# EAGLE design PSU-Unit (EAGLE 8.2.0)
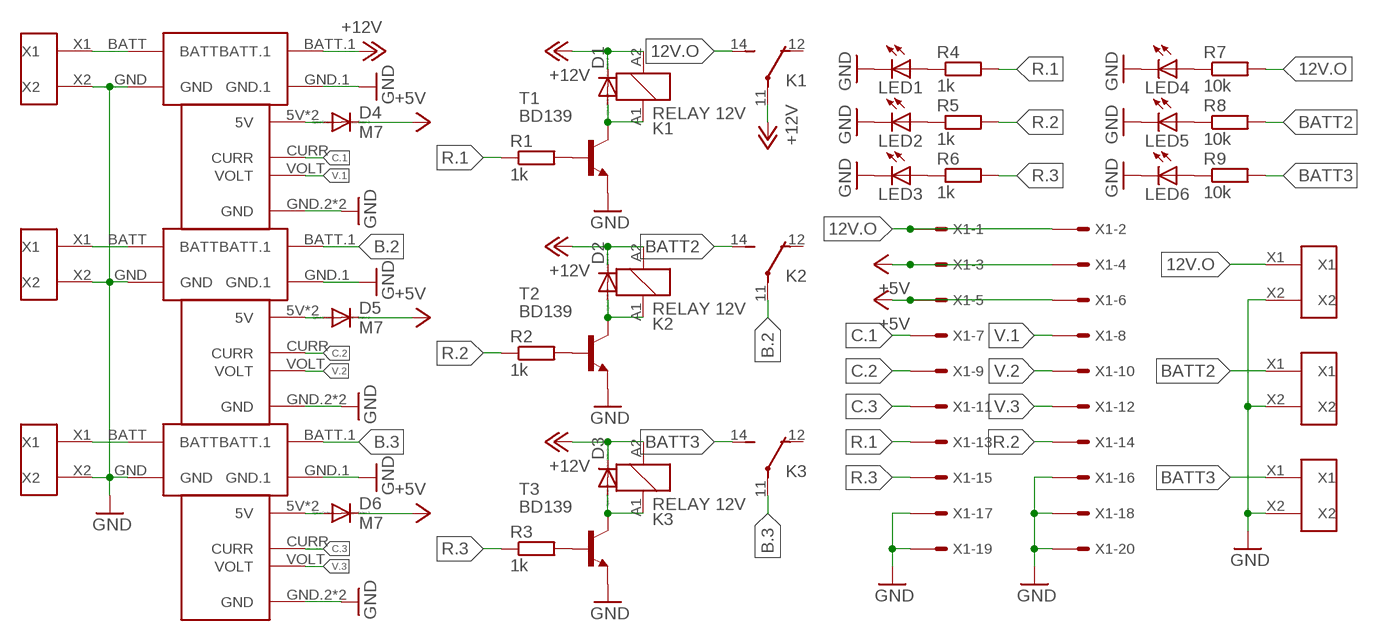
[diagram p0: schematic, sheet 1]

## Parts
D1  DIODE-DO214AA  [DO214AA]
D2  DIODE-DO214AA  [DO214AA]
D3  DIODE-DO214AA  [DO214AA]
D4  M7  DIODE-DO214AA  [DO214AA]
D5  M7  DIODE-DO214AA  [DO214AA]
D6  M7  DIODE-DO214AA  [DO214AA]
K1  RELAY 12V  ZD312006  [ZD1]
K2  RELAY 12V  ZD312006  [ZD1]
K3  RELAY 12V  ZD312006  [ZD1]
LED1  LEDCHIPLED_1206  [CHIPLED_1206]
LED2  LEDCHIPLED_1206  [CHIPLED_1206]
LED3  LEDCHIPLED_1206  [CHIPLED_1206]
LED4  LEDCHIPLED_1206  [CHIPLED_1206]
LED5  LEDCHIPLED_1206  [CHIPLED_1206]
LED6  LEDCHIPLED_1206  [CHIPLED_1206]
R1  1k  R-EU_R0805  [R0805]
R2  1k  R-EU_R0805  [R0805]
R3  1k  R-EU_R0805  [R0805]
R4  1k  R-EU_R0805  [R0805]
R5  1k  R-EU_R0805  [R0805]
R6  1k  R-EU_R0805  [R0805]
R7  10k  R-EU_R0805  [R0805]
R8  10k  R-EU_R0805  [R0805]
R9  10k  R-EU_R0805  [R0805]
T1  BD139  -NPN-TO126V  [TO126V]
T2  BD139  -NPN-TO126V  [TO126V]
T3  BD139  -NPN-TO126V  [TO126V]
U$1  APM-POWER-MODULE  [APM-POWER-MODULE]
U$2  APM-MEASURAND  [APM-MEASURAND]
U$3  APM-POWER-MODULE  [APM-POWER-MODULE]
U$4  APM-MEASURAND  [APM-MEASURAND]
U$5  APM-POWER-MODULE  [APM-POWER-MODULE]
U$6  APM-MEASURAND  [APM-MEASURAND]
U$7  T-BLOCK-9.5MM  [T-BLOCK-9.5MM]
U$8  T-BLOCK-9.5MM  [T-BLOCK-9.5MM]
U$9  T-BLOCK-9.5MM  [T-BLOCK-9.5MM]
U$10  T-BLOCK-9.5MM  [T-BLOCK-9.5MM]
U$11  T-BLOCK-9.5MM  [T-BLOCK-9.5MM]
U$12  T-BLOCK-9.5MM  [T-BLOCK-9.5MM]
X1  057-020-1  [057-020-1]

## Nets
12V.O: K1.14(2:S) R7.2 U$10.X1 X1.1 X1.2
+5V: D4.C D5.C D6.C X1.3 X1.4 X1.5 X1.6
+12V: D1.C D2.C D3.C K1.11(2:P) K1.A2 K2.A2 K3.A2 U$1.BATT.1
B.2: K2.11(2:P) U$3.BATT.1
B.3: K3.11(2:P) U$5.BATT.1
BATT2: K2.14(2:S) R8.2 U$11.X1
BATT3: K3.14(2:S) R9.2 U$12.X1
C.1: U$2.CURR X1.7
C.2: U$4.CURR X1.9
C.3: U$6.CURR X1.11
GND: LED1.C LED2.C LED3.C LED4.C LED5.C LED6.C T1.1(E) T2.1(E) T3.1(E) U$1.GND U$1.GND.1 U$2.GND.2(GND) U$2.GND.3(GND) U$3.GND U$3.GND.1 U$4.GND.2(GND) U$4.GND.3(GND) U$5.GND U$5.GND.1 U$6.GND.2(GND) U$6.GND.3(GND) U$7.X2 U$8.X2 U$9.X2 U$10.X2 U$11.X2 U$12.X2 X1.16 X1.17 X1.18 X1.19 X1.20
N$1: D1.A K1.A1 T1.2(C)
N$2: D4.A U$2.5V U$2.5V.1(5V)
N$3: R1.2 T1.3(B)
N$4: D5.A U$4.5V U$4.5V.1(5V)
N$5: D2.A K2.A1 T2.2(C)
N$6: R2.2 T2.3(B)
N$7: D6.A U$6.5V U$6.5V.1(5V)
N$8: D3.A K3.A1 T3.2(C)
N$9: R3.2 T3.3(B)
N$10: U$1.BATT U$7.X1
N$11: U$3.BATT U$8.X1
N$12: U$5.BATT U$9.X1
N$13: LED1.A R4.1
N$14: LED2.A R5.1
N$15: LED3.A R6.1
N$16: LED4.A R7.1
N$17: LED5.A R8.1
N$18: LED6.A R9.1
R.1: R1.1 R4.2 X1.13
R.2: R2.1 R5.2 X1.14
R.3: R3.1 R6.2 X1.15
V.1: U$2.VOLT X1.8
V.2: U$4.VOLT X1.10
V.3: U$6.VOLT X1.12
Unconnected: K1.12(2:O) K2.12(2:O) K3.12(2:O)

## Library data of the parts
D1-D6 = diode:DIODE-: DIODE
K1-K3 = relay:ZD?1*: Power Relay SCHRACK 1 pole 30 A Source: http://www.schrack.com/.. 5848.pdf; OC_FARNELL: unknown; OC_NEWARK: unknown
LED1-LED6 = led:LED: LED OSRAM: - CHIPLED LG R971, LG N971, LY N971, LG Q971, LY Q971, LO R971, LY R971 LH N974, LH R974 LS Q976, LO Q976, LY Q976 LO Q996 - Hyper CHIPLED LW Q18S LB Q993, LB Q99A, LB R99A - SideLED LS A670, LO A670, LY A670, LG A670, LP A670 LB A673, LV A673, LT A673, LW A673 LH A674 LY A675 LS A676, LA A676, LO A676, LY A676, LW A676 LS A679, LY A679, LG A679 - Hyper Micro SIDELED® LS Y876, LA Y876, LO Y876, LY Y876 LT Y87S - SmartLED LW L88C, LW L88S LB L89C, LB L89S, LG L890 LS L89K, LO L89K, LY L89K LS L896, LA L896, LO L896, LY L896 - TOPLED LS T670, LO T670, LY T670, LG T670, LP T670 LSG T670, LSP T670, LSY T670, LOP T670, LYG T670 LG T671, LOG T671, LSG T671 LB T673, LV T673, LT T673, LW T673 LH T674 LS T676, LA T676, LO T676, LY T676, LB T676, LH T676, LSB T676, LW T676 LB T67C, LV T67C, LT T67C, LS T67K, LO T67K, LY T67K, LW E67C LS E67B, LA E67B, LO E67B, LY E67B, LB E67C, LV E67C, LT E67C LW T67C LS T679, LY T679, LG T679 LS T770, LO T770, LY T770, LG T770, LP T770 LB T773, LV T773, LT T773, LW T773 LH T774 LS E675, LA E675, LY E675, LS T675 LS T776, LA T776, LO T776, LY T776, LB T776 LHGB T686 LT T68C, LB T68C - Hyper Mini TOPLED® LB M676 - Mini TOPLED Santana® LG M470 LS M47K, LO M47K, LY M47K Source: http://www.osram.convergy.de LUXEON: - LUMILED® LXK2-PW12-R00, LXK2-PW12-S00, LXK2-PW14-U00, LXK2-PW14-V00 LXK2-PM12-R00, LXK2-PM12-S00, LXK2-PM14-U00 LXK2-PE12-Q00, LXK2-PE12-R00, LXK2-PE12-S00, LXK2-PE14-T00, LXK2-PE14-U00 LXK2-PB12-K00, LXK2-PB12-L00, LXK2-PB12-M00, LXK2-PB14-N00, LXK2-PB14-P00, LXK2-PB14-Q00 LXK2-PR12-L00, LXK2-PR12-M00, LXK2-PR14-Q00, LXK2-PR14-R00 LXK2-PD12-Q00, LXK2-PD12-R00, LXK2-PD12-S00 LXK2-PH12-R00, LXK2-PH12-S00 LXK2-PL12-P00, LXK2-PL12-Q00, LXK2-PL12-R00 Source: www.luxeon.com KINGBRIGHT: KA-3528ASYC Source: www.kingbright.com
R1-R9 = rcl:R-EU_: RESISTOR, European symbol
T1-T3 = transistor:*-NPN-: NPN Transistror BF959 corrected 2008.03.06
U$1 U$3 U$5 = adafruit-other-customs:APM-POWER-MODULE
U$2 U$4 U$6 = adafruit-other-customs:APM-MEASURAND
U$7-U$12 = adafruit-other-customs:T-BLOCK-9.5MM
X1 = con-panduit:057-020-: CONNECTOR 20-pin series 057 contact pc board low profile headers; OC_FARNELL: unknown; OC_NEWARK: unknown

## Board
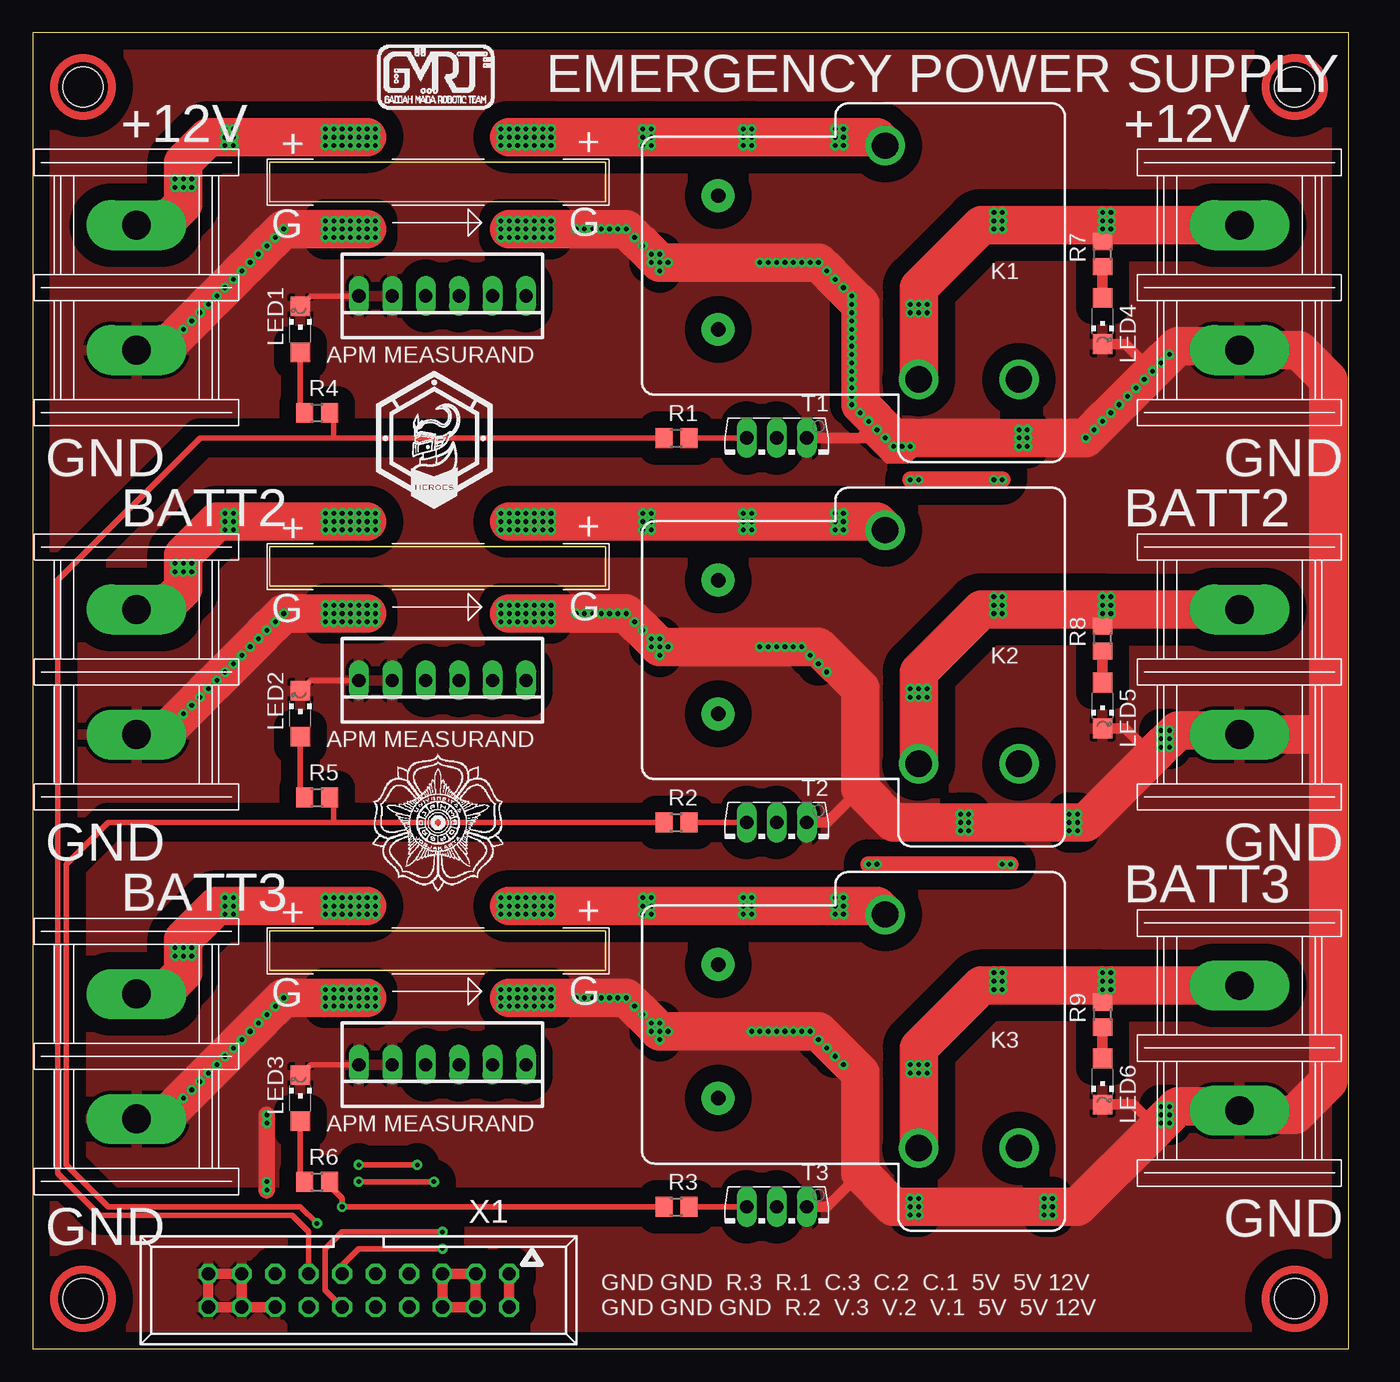
[diagram p1: board, top side]
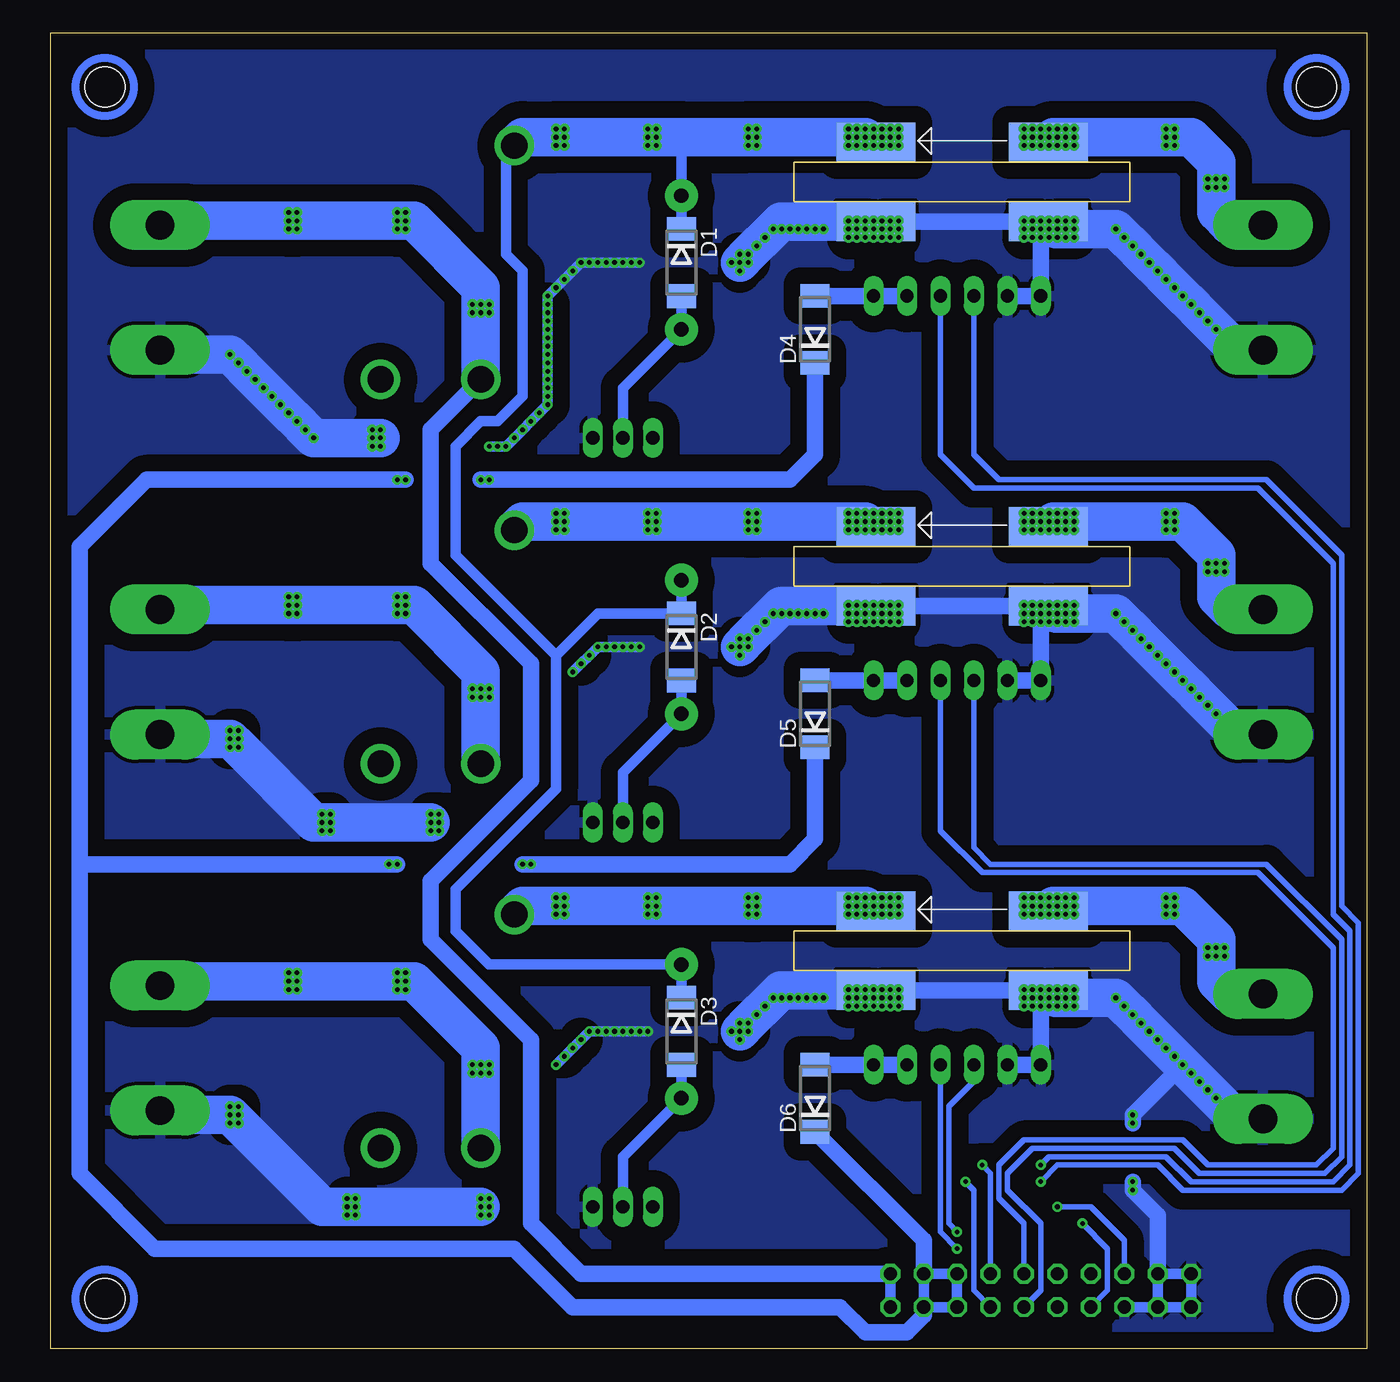
[diagram p2: board, bottom side, seen from below]

Size 100 x 100 mm. Coordinates in mm from the lower left corner, seen from the top.
Outline: 0,0 100,0 100,100 0,100 0,0
Copper layers (1*16): Top 0.035mm / dielectric 1.5mm / Bottom 0.035mm
Design rules "default": minimum track width 6mil, minimum drill 0.35mm, track to track 6mil, track to pad 6mil, pad to pad 6mil, via to via 6mil, smd to smd 6mil, copper to edge 40mil, drill to drill 6mil, minimum pad ring 10mil, minimum via ring 8mil, stop-mask expansion 4mil, vias tented up to drill 0mil, thermal gap 10mil

### Footprints (pad centres in the part's own frame; a part is rotated, then mirrored left to right if it is on the bottom)
DO214AA = smd 1.8 x 2.2: A 2.55,0; C -2.55,0
ZD1 = drill 2 pad 2.5: 11 -2.54,-8.88; 12 -12.7,8.88; 14 -5.08,8.88 | drill 1.1 pad 2.5: A1 10.16,5.08; A2 10.16,-5.08
CHIPLED_1206 = smd 1.5 x 1.5: A 0,-1.75; C 0,1.75
R0805 = smd 1.3 x 1.5: 1 -0.95,0; 2 0.95,0
TO126V = drill 1.016 long: 1 -2.286,-1.27; 2 0,-1.27; 3 2.286,-1.27
APM-POWER-MODULE = smd 6 x 3 bottom: BATT -6.921,2.794; BATT.1 6.16,2.794; GND -6.921,-3.239; GND.1 6.16,-3.239
APM-MEASURAND = drill 1 long: 5V -6.35,0; 5V.1 -3.81,0; CURR -1.27,0; GND.2 3.81,0; GND.3 6.35,0; VOLT 1.27,0
T-BLOCK-9.5MM = drill 2.184 pad 3.81 long: X1 -4.75,0.25; X2 4.75,0.25
HOLE-3MM = hole 3.05: 0,0
057-020-1 = drill 1 octagon: 1 -11.43,-1.27; 2 -11.43,1.27; 3 -8.89,-1.27; 4 -8.89,1.27; 5 -6.35,-1.27; 6 -6.35,1.27; 7 -3.81,-1.27; 8 -3.81,1.27; 9 -1.27,-1.27; 10 -1.27,1.27; 11 1.27,-1.27; 12 1.27,1.27; 13 3.81,-1.27; 14 3.81,1.27; 15 6.35,-1.27; 16 6.35,1.27; 17 8.89,-1.27; 18 8.89,1.27; 19 11.43,-1.27; 20 11.43,1.27

### Placement (x,y rotation side)
D1  52.07,82.55 270 bottom
D2  52.07,53.34 270 bottom
D3  52.07,24.13 270 bottom
D4  41.91,77.47 90 bottom
D5  41.91,48.26 90 bottom
D6  41.91,19.05 90 bottom
K1  62.23,82.55 180 top
K2  62.23,53.34 180 top
K3  62.23,24.13 180 top
LED1  20.32,77.47 0 top
LED2  20.32,48.26 0 top
LED3  20.32,19.05 0 top
LED4  81.28,78.11 180 top
LED5  81.28,48.9 180 top
LED6  81.28,20.32 180 top
R1  48.9,69.22 0 top
R2  48.9,40.01 0 top
R3  48.9,10.79 0 top
R4  21.59,71.12 0 top
R5  21.59,41.91 0 top
R6  21.59,12.7 0 top
R7  81.28,83.19 90 top
R8  81.28,53.98 90 top
R9  81.28,25.4 90 top
T1  56.52,67.94 180 top
T2  56.52,38.73 180 top
T3  56.52,9.53 180 top
U$1  31.11,88.9 0 top
U$2  31.11,80.01 180 top
U$3  31.11,59.69 0 top
U$4  31.11,50.8 180 top
U$5  31.11,30.48 0 top
U$6  31.11,21.59 180 top
U$7  7.62,80.64 270 top
U$8  7.62,51.44 270 top
U$9  7.62,22.23 270 top
U$10  91.44,80.64 270 top
U$11  91.44,51.44 270 top
U$12  91.44,22.86 270 top
U$13  [HOLE-3MM]  3.81,95.89 0 top
U$14  [HOLE-3MM]  3.81,3.81 0 top
U$15  [HOLE-3MM]  95.89,95.89 0 top
U$16  [HOLE-3MM]  95.89,3.81 0 top
X1  24.77,4.45 180 top

### Tracks (layer width: path | path; a pad name or v marks a point on that pad's centre or on a via)
12V.O  (via drill 0.35)
  Top 0.813: R7.2 v81.28,85.09 81.28,85.39 | X1.1 X1.2
  Top 2.921: U$10.X1 81.28,85.39 72.06,85.39 67.31,80.64 v67.31,79.38 v67.31,78.74 K1.14
  Bottom 0.813: X1.1 X1.2
  Bottom 1.27: K1.14 71.12,69.85 71.12,59.69 63.5,52.07 63.5,43.18 71.12,35.56 71.12,31.11 63.5,23.5 63.5,9.53 59.69,5.71 X1.1
  Bottom 2.921: K1.14 v67.31,78.74 v67.31,79.38 67.31,80.64 72.39,85.72 v73.03,85.72 v73.66,85.72 v81.28,85.72 v81.92,85.72 91.44,85.72
+5V  (via drill 0.35)
  Top 0.813: X1.5 X1.6 X1.4 X1.3 X1.5
  Top 1.27: v66.67,66.04 v67.31,66.04 v73.03,66.04 v73.66,66.04 | v63.5,36.83 v64.14,36.83 v73.66,36.83 v74.3,36.83
  Bottom 0.813: X1.5 X1.6 X1.4 X1.3 X1.5
  Bottom 1.27: D6.C 33.66,8.26 X1.3 | D4.C 41.91,67.94 43.81,66.04 v66.67,66.04 v67.31,66.04 | 97.79,36.83 97.79,60.96 92.71,66.04 v73.66,66.04 v73.03,66.04 | 97.79,36.83 97.79,13.34 92.08,7.62 64.77,7.62 60.33,3.17 40.01,3.17 38.1,1.27 34.92,1.27 33.66,2.54 X1.4 | D5.C 41.91,38.73 43.81,36.83 v63.5,36.83 v64.14,36.83 | v73.66,36.83 v74.3,36.83 97.79,36.83
+12V  (via drill 0.35)
  Top 2.921: v36.2,92.08 v36.83,92.08 v37.47,92.08 v38.1,92.08 v38.73,92.08 v39.37,92.08 v46.35,92.08 v46.99,92.08 v53.98,92.08 v54.61,92.08 v60.96,92.08 v61.59,92.08 64.14,92.08 K1.11
  Bottom 0.813: D1.C K1.A2 52.07,92.08 | K2.A2 D2.C 58.41,55.89 61.59,52.7 | D3.C K3.A2 66.67,29.21 69.22,31.75 69.22,34.92 61.59,42.55 61.59,52.7 | 61.59,52.7 69.22,60.33 69.22,68.58 67.31,70.48 66.04,70.48 64.14,72.39 64.14,81.92 65.41,83.19 65.41,90.8 K1.11
  Bottom 2.921: U$1.BATT.1 37.72,91.69 v38.1,92.08 v38.73,92.08 v39.37,92.08 v46.35,92.08 v46.99,92.08 52.07,92.08 v53.98,92.08 v54.61,92.08 v60.96,92.08 v61.59,92.08 64.12,92.08 K1.11
B.2  (via drill 0.35)
  Top 2.921: v36.2,62.87 v36.83,62.87 v37.47,62.87 v38.1,62.87 v38.73,62.87 v39.37,62.87 v46.35,62.87 v46.99,62.87 v53.98,62.87 v54.61,62.87 v60.96,62.87 v61.59,62.87 64.14,62.87 K2.11
  Bottom 2.921: U$3.BATT.1 37.72,62.48 v38.1,62.87 v38.73,62.87 v39.37,62.87 v46.35,62.87 v46.99,62.87 v53.98,62.87 v54.61,62.87 v60.96,62.87 v61.59,62.87 64.12,62.87 K2.11
B.3  (via drill 0.35)
  Top 2.921: v36.2,33.66 v36.83,33.66 v37.47,33.66 v38.1,33.66 v38.73,33.66 v39.37,33.66 v46.35,33.66 v46.99,33.66 v53.98,33.66 v54.61,33.66 v60.96,33.66 v61.59,33.66 64.14,33.66 K3.11
  Bottom 2.921: U$5.BATT.1 37.72,33.27 v38.1,33.66 v38.73,33.66 v39.37,33.66 v46.35,33.66 v46.99,33.66 v53.98,33.66 v54.61,33.66 v60.96,33.66 v61.59,33.66 64.12,33.66 K3.11
BATT2  (via drill 0.35)
  Top 0.813: R8.2 v81.28,55.88 81.28,56.19
  Top 2.921: U$11.X1 81.28,56.19 72.06,56.19 67.31,51.44 v67.31,50.16 v67.31,49.53 K2.14
  Bottom 2.921: K2.14 v67.31,49.53 v67.31,50.16 67.31,51.44 72.39,56.52 v73.03,56.52 v73.66,56.52 v81.28,56.52 v81.92,56.52 91.44,56.52
BATT3  (via drill 0.35)
  Top 0.813: R9.2 v81.28,27.3 81.28,27.61
  Top 2.921: U$12.X1 81.28,27.61 72.06,27.61 67.31,22.86 v67.31,21.59 v67.31,20.95 K3.14
  Bottom 2.921: K3.14 v67.31,20.95 v67.31,21.59 67.31,22.86 72.39,27.94 v73.03,27.94 v73.66,27.94 v81.28,27.94 v81.92,27.94 91.44,27.94
C.1  (via drill 0.35)
  Top 0.406: v24.77,13.97 v29.21,13.97
  Bottom 0.406: U$2.CURR 32.38,67.94 29.84,65.41 8.26,65.41 2.54,59.69 2.54,33.02 1.27,31.75 1.27,13.97 2.54,12.7 13.34,12.7 15.24,14.61 24.13,14.61 v24.77,13.97 | v29.21,13.97 28.57,13.34 X1.7
C.2
  Bottom 0.406: U$4.CURR 32.38,39.37 29.21,36.2 8.26,36.2 2.54,30.48 2.54,15.24 3.81,13.97 12.06,13.97 13.97,15.88 26.04,15.88 27.94,13.97 27.94,11.43 26.04,9.53 X1.9
C.3  (via drill 0.35)
  Top 0.406: v31.11,7.62 24.77,7.62 23.5,6.35 X1.11
  Bottom 0.406: U$6.CURR 32.38,8.89 v31.11,7.62
GND  (via drill 0.35)
  Top 0.406: U$4.GND.3 21.11,50.8 LED2.C | U$2.GND.3 21.11,80.01 LED1.C | U$6.GND.3 21.11,21.59 LED3.C
  Top 0.813: T1.1 62.87,69.22 | 62.87,69.22 63.45,69.22 65.02,67.64 66.43,67.64 66.98,68.19 66.98,68.88 67.31,69.22 | T2.1 60.33,40.01 62.87,42.55 | T3.1 60.33,10.79 62.87,13.34 | 62.87,69.22 63.2,69.55 | LED4.C 83.03,76.36 v85.09,74.3 | LED5.C 83.03,47.15 85.09,45.09 | LED6.C 83.61,18.57 85.7,16.48 85.12,16.48 85.09,16.51 | X1.18 X1.20 X1.19 X1.17 X1.18 | X1.18 X1.16
  Top 1.27: v17.78,12.06 v17.78,12.7 v17.78,17.14 v17.78,17.78
  Top 2.921: v36.2,85.09 v36.83,85.09 v37.47,85.09 v38.1,85.09 v38.73,85.09 v39.37,85.09 v41.27,85.09 v41.91,85.09 v42.55,85.09 v43.18,85.09 v43.81,85.09 v44.45,85.09 v45.09,85.09 v45.72,84.45 v46.35,83.82 v46.99,83.19 v47.62,82.55 v48.26,82.55 v55.24,82.55 v55.88,82.55 v56.52,82.55 v57.15,82.55 v57.78,82.55 v58.42,82.55 v59.05,82.55 v59.69,82.55 v60.33,81.92 v60.96,81.28 v61.59,80.64 v62.23,80.01 62.87,79.38 62.87,71.75 65.41,69.22 67.31,69.22 v74.93,69.22 v75.56,69.22 v80.01,69.22 v80.64,69.85 v81.28,70.48 v81.92,71.12 v82.55,71.75 v83.19,72.39 v83.82,73.03 v84.45,73.66 v85.09,74.3 v85.72,74.93 v86.36,75.56 87,76.2 91.39,76.2 U$10.X2 96.19,75.89 98.42,73.66 98.42,46.99 | 8.26,76.2 10.16,76.2 v11.43,77.47 v12.06,78.11 v12.7,78.74 v13.34,79.38 v13.97,80.01 v14.61,80.64 v15.24,81.28 v15.88,81.92 v16.51,82.55 v17.14,83.19 v17.78,83.82 v18.41,84.45 v19.05,85.09 v22.23,85.09 v22.86,85.09 v23.5,85.09 v24.13,85.09 v24.77,85.09 v25.4,85.09 | v36.2,55.88 v36.83,55.88 v37.47,55.88 v38.1,55.88 v38.73,55.88 v39.37,55.88 v41.27,55.88 v41.91,55.88 v42.55,55.88 v43.18,55.88 v43.81,55.88 v44.45,55.88 v45.09,55.88 v45.72,55.24 v46.35,54.61 v46.99,53.98 v47.62,53.34 v48.26,53.34 v55.24,53.34 v55.88,53.34 v56.52,53.34 v57.15,53.34 v57.78,53.34 v58.42,53.34 59.69,53.34 62.87,50.16 62.87,42.55 65.41,40.01 v70.48,40.01 v71.12,40.01 v78.74,40.01 v79.38,40.01 80.01,40.01 85.09,45.09 v85.72,45.72 v86.36,46.35 87,46.99 91.44,46.99 91.44,46.94 U$11.X2 98.12,46.69 98.42,46.99 | v36.2,26.67 v36.83,26.67 v37.47,26.67 v38.1,26.67 v38.73,26.67 v39.37,26.67 v41.27,26.67 v41.91,26.67 v42.55,26.67 v43.18,26.67 v43.81,26.67 v44.45,26.67 v45.09,26.67 v45.72,26.04 v46.35,25.4 v46.99,24.77 v47.62,24.13 v48.26,24.13 v54.61,24.13 v55.24,24.13 v55.88,24.13 v56.52,24.13 v57.15,24.13 v57.78,24.13 v58.42,24.13 v59.05,24.13 59.69,24.13 62.87,20.95 62.87,13.34 65.41,10.79 v66.67,10.79 v67.31,10.79 v76.83,10.79 v77.47,10.79 79.38,10.79 85.09,16.51 v85.72,17.14 v86.36,17.78 87,18.41 91.39,18.41 U$12.X2 92.02,17.78 95.89,17.78 98.42,20.32 98.42,46.99
  Top 2.921: 7.62,46.99 10.16,46.99 v11.43,48.26 v12.06,48.9 v12.7,49.53 v13.34,50.16 v13.97,50.8 v14.61,51.44 v15.24,52.07 v15.88,52.7 v16.51,53.34 v17.14,53.98 v17.78,54.61 v18.41,55.24 v19.05,55.88 v22.23,55.88 v22.86,55.88 v23.5,55.88 v24.13,55.88 v24.77,55.88 v25.4,55.88 | 8.26,17.78 10.16,17.78 v11.43,19.05 v12.06,19.68 v12.7,20.32 v13.34,20.95 v13.97,21.59 v14.61,22.23 v15.24,22.86 v15.88,23.5 v16.51,24.13 v17.14,24.77 v17.78,25.4 v18.41,26.04 v19.05,26.67 v22.23,26.67 v22.86,26.67 v23.5,26.67 v24.13,26.67 v24.77,26.67 v25.4,26.67
  Bottom 0.813: v55.24,82.55 v59.69,82.55 v62.23,80.01 62.23,71.75 v65.41,68.58 v66.67,68.58 | v55.24,53.34 v58.42,53.34 v60.33,51.44 | v54.61,24.13 v59.05,24.13 v61.59,21.59 | X1.18 X1.16 | X1.18 X1.20 X1.19 X1.17 X1.18
  Bottom 1.27: U$1.GND.1 25.34,85.66 v24.77,85.09 U$2.GND.3 U$2.GND.2 | 24.83,56.45 U$3.GND.1 | 24.83,56.45 24.77,56.52 | U$4.GND.2 U$4.GND.3 24.77,56.39 24.83,56.45 | U$5.GND.1 24.83,27.24 24.77,27.3 v24.77,26.67 | v25.4,26.67 24.77,26.04 U$6.GND.3 U$6.GND.2 | X1.17 15.88,10.16 v17.78,12.06 v17.78,12.7 | v17.78,17.14 v17.78,17.78 v13.97,21.59
  Bottom 2.921: U$7.X2 9.86,75.89 v11.43,77.47 v12.06,78.11 v12.7,78.74 v13.34,79.38 v13.97,80.01 v14.61,80.64 v15.24,81.28 v15.88,81.92 v16.51,82.55 v17.14,83.19 v17.78,83.82 v18.41,84.45 v19.05,85.09 v22.23,85.09 v22.86,85.09 v23.5,85.09 23.62,85.09 U$1.GND | U$8.X2 9.86,46.69 v11.43,48.26 v12.06,48.9 v12.7,49.53 v13.34,50.16 v13.97,50.8 v14.61,51.44 v15.24,52.07 v15.88,52.7 v16.51,53.34 v17.14,53.98 v17.78,54.61 v18.41,55.24 v19.05,55.88 v22.23,55.88 v22.86,55.88 v23.5,55.88 23.62,55.88 U$3.GND | U$9.X2 9.86,17.48 v11.43,19.05 v12.06,19.68 v12.7,20.32 v13.34,20.95 v13.97,21.59 v14.61,22.23 v15.24,22.86 v15.88,23.5 v16.51,24.13 v17.14,24.77 v17.78,25.4 v18.41,26.04 v19.05,26.67 v22.23,26.67 v22.86,26.67 v23.5,26.67 23.62,26.67 U$5.GND | U$1.GND.1 44.51,85.66 v45.09,85.09 v45.72,84.45 v46.35,83.82 v46.99,83.19 v47.62,82.55 | U$3.GND.1 44.51,56.45 v45.09,55.88 v45.72,55.24 v46.35,54.61 v46.99,53.98 v47.62,53.34 | U$5.GND.1 44.51,27.24 v45.09,26.67 v45.72,26.04 v46.35,25.4 v46.99,24.77 v47.62,24.13 | 91.44,75.56 v86.36,75.56 v85.72,74.93 v85.09,74.3 v84.45,73.66 v83.82,73.03 v83.19,72.39 v82.55,71.75 v81.92,71.12 v81.28,70.48 v80.64,69.85 v80.01,69.22 v75.56,69.22 v74.93,69.22 | 91.44,46.35 v86.36,46.35 v85.72,45.72 80.01,40.01 v79.38,40.01 v78.74,40.01 v71.12,40.01 | 91.44,17.78 v86.36,17.78 v85.72,17.14 79.38,10.79 v77.47,10.79 v76.83,10.79 v67.31,10.79
  pour Top (isolate 1.27): 0,100.33 0,0 100.33,0 100.33,100.33
  pour Bottom (isolate 1.27): -1.27,100.33 -1.27,0 100.33,0 100.33,100.33
N$1
  Bottom 0.813: D1.A K1.A1 56.52,73.03 T1.2
N$2
  Bottom 1.27: U$2.5V.1 U$2.5V D4.A
N$3
  Top 0.406: R1.2 T1.3
N$4
  Bottom 1.27: U$4.5V.1 U$4.5V D5.A
N$5
  Bottom 0.813: T2.2 56.52,43.81 K2.A1 D2.A
N$6
  Top 0.406: R2.2 T2.3
N$7
  Bottom 1.27: U$6.5V.1 U$6.5V D6.A
N$8
  Bottom 0.813: T3.2 56.52,14.61 K3.A1 D3.A
N$9
  Top 0.406: R3.2 T3.3
N$10  (via drill 0.35)
  Top 2.921: 8.26,85.72 10.16,85.72 11.43,87 v11.43,88.27 v11.43,88.9 11.43,90.17 13.34,92.08 v14.61,92.08 v15.24,92.08 v22.23,92.08 v22.86,92.08 v23.5,92.08 v24.13,92.08 v24.77,92.08 v25.4,92.08
  Bottom 2.921: U$7.X1 10.46,85.39 11.43,86.36 v11.43,88.27 v11.43,88.9 11.43,90.17 13.34,92.08 v14.61,92.08 v15.24,92.08 v22.23,92.08 v22.86,92.08 v23.5,92.08 23.81,92.08 U$1.BATT
N$11  (via drill 0.35)
  Top 2.921: 8.26,56.52 10.16,56.52 11.43,57.78 v11.43,59.05 v11.43,59.69 11.43,60.33 13.97,62.87 v14.61,62.87 v15.24,62.87 v22.23,62.87 v22.86,62.87 v23.5,62.87 v24.13,62.87 v24.77,62.87 v25.4,62.87
  Bottom 2.921: U$8.X1 10.46,56.19 11.43,57.15 v11.43,59.05 v11.43,59.69 11.43,60.33 13.97,62.87 v14.61,62.87 v15.24,62.87 v22.23,62.87 v22.86,62.87 v23.5,62.87 23.81,62.87 U$3.BATT
N$12  (via drill 0.35)
  Top 2.921: 8.26,27.3 10.16,27.3 11.43,28.57 v11.43,29.84 v11.43,30.48 11.43,31.11 13.97,33.66 v14.61,33.66 v15.24,33.66 v22.23,33.66 v22.86,33.66 v23.5,33.66 v24.13,33.66 v24.77,33.66 v25.4,33.66
  Bottom 2.921: U$9.X1 10.46,26.98 11.43,27.94 v11.43,29.84 v11.43,30.48 11.43,31.11 13.97,33.66 v14.61,33.66 v15.24,33.66 v22.23,33.66 v22.86,33.66 v23.5,33.66 23.81,33.66 U$5.BATT
N$13
  Top 0.406: LED1.A 20.32,71.44 R4.1
N$14
  Top 0.406: LED2.A 20.32,42.23 R5.1
N$15
  Top 0.406: LED3.A 20.32,13.02 R6.1
N$16
  Top 0.813: R7.1 LED4.A
N$17
  Top 0.813: R8.1 LED5.A
N$18
  Top 0.813: R9.1 LED6.A
N$19  (via drill 0.35)
  other vias: 10.79,59.69
N$20  (via drill 0.35)
  other vias: 10.79,59.05
N$21  (via drill 0.35)
  other vias: 12.06,59.05
N$22  (via drill 0.35)
  other vias: 14.61,33.02
N$23  (via drill 0.35)
  other vias: 26.04,34.29
N$24  (via drill 0.35)
  other vias: 54.61,92.71
N$25  (via drill 0.35)
  other vias: 10.79,88.27
N$26  (via drill 0.35)
  other vias: 12.06,88.27
N$27  (via drill 0.35)
  other vias: 12.06,88.9
N$28  (via drill 0.35)
  other vias: 10.79,88.9
N$29  (via drill 0.35)
  other vias: 14.61,92.71
N$30  (via drill 0.35)
  other vias: 14.61,91.44
N$31  (via drill 0.35)
  other vias: 15.24,91.44
N$32  (via drill 0.35)
  other vias: 15.24,92.71
N$33  (via drill 0.35)
  other vias: 22.23,92.71
N$34  (via drill 0.35)
  other vias: 22.23,91.44
N$35  (via drill 0.35)
  other vias: 22.86,91.44
N$36  (via drill 0.35)
  other vias: 23.5,91.44
N$37  (via drill 0.35)
  other vias: 24.13,91.44
N$38  (via drill 0.35)
  other vias: 24.77,91.44
N$39  (via drill 0.35)
  other vias: 25.4,91.44
N$40  (via drill 0.35)
  other vias: 26.04,91.44
N$41  (via drill 0.35)
  other vias: 26.04,92.08
N$42  (via drill 0.35)
  other vias: 26.04,92.71
N$43  (via drill 0.35)
  other vias: 22.86,92.71
N$44  (via drill 0.35)
  other vias: 23.5,92.71
N$45  (via drill 0.35)
  other vias: 24.13,92.71
N$46  (via drill 0.35)
  other vias: 24.77,92.71
N$47  (via drill 0.35)
  other vias: 25.4,92.71
N$48  (via drill 0.35)
  other vias: 35.56,92.71
N$49  (via drill 0.35)
  other vias: 35.56,92.08
N$50  (via drill 0.35)
  other vias: 35.56,91.44
N$51  (via drill 0.35)
  other vias: 36.2,91.44
N$52  (via drill 0.35)
  other vias: 36.83,91.44
N$53  (via drill 0.35)
  other vias: 37.47,91.44
N$54  (via drill 0.35)
  other vias: 38.1,91.44
N$55  (via drill 0.35)
  other vias: 38.73,91.44
N$56  (via drill 0.35)
  other vias: 39.37,91.44
N$57  (via drill 0.35)
  other vias: 39.37,92.71
N$58  (via drill 0.35)
  other vias: 38.73,92.71
N$59  (via drill 0.35)
  other vias: 38.1,92.71
N$60  (via drill 0.35)
  other vias: 37.47,92.71
N$61  (via drill 0.35)
  other vias: 36.83,92.71
N$62  (via drill 0.35)
  other vias: 36.2,92.71
N$63  (via drill 0.35)
  other vias: 46.35,92.71
N$64  (via drill 0.35)
  other vias: 46.35,91.44
N$65  (via drill 0.35)
  other vias: 46.99,91.44
N$66  (via drill 0.35)
  other vias: 46.99,92.71
N$67  (via drill 0.35)
  other vias: 60.96,92.71
N$68  (via drill 0.35)
  other vias: 60.96,91.44
N$69  (via drill 0.35)
  other vias: 61.59,91.44
N$70  (via drill 0.35)
  other vias: 61.59,92.71
N$71  (via drill 0.35)
  other vias: 12.06,59.69
N$72  (via drill 0.35)
  other vias: 15.24,62.23
N$73  (via drill 0.35)
  other vias: 15.24,63.5
N$74  (via drill 0.35)
  other vias: 14.61,63.5
N$75  (via drill 0.35)
  other vias: 14.61,62.23
N$76  (via drill 0.35)
  other vias: 26.04,63.5
N$77  (via drill 0.35)
  other vias: 26.04,62.87
N$78  (via drill 0.35)
  other vias: 26.04,62.23
N$79  (via drill 0.35)
  other vias: 25.4,62.23
N$80  (via drill 0.35)
  other vias: 24.77,62.23
N$81  (via drill 0.35)
  other vias: 24.13,62.23
N$82  (via drill 0.35)
  other vias: 23.5,62.23
N$83  (via drill 0.35)
  other vias: 22.86,62.23
N$84  (via drill 0.35)
  other vias: 22.23,62.23
N$85  (via drill 0.35)
  other vias: 22.23,63.5
N$86  (via drill 0.35)
  other vias: 22.86,63.5
N$87  (via drill 0.35)
  other vias: 23.5,63.5
N$88  (via drill 0.35)
  other vias: 24.13,63.5
N$89  (via drill 0.35)
  other vias: 24.77,63.5
N$90  (via drill 0.35)
  other vias: 25.4,63.5
N$91  (via drill 0.35)
  other vias: 35.56,63.5
N$92  (via drill 0.35)
  other vias: 35.56,62.87
N$93  (via drill 0.35)
  other vias: 35.56,62.23
N$94  (via drill 0.35)
  other vias: 36.2,62.23
N$95  (via drill 0.35)
  other vias: 36.83,62.23
N$96  (via drill 0.35)
  other vias: 37.47,62.23
N$97  (via drill 0.35)
  other vias: 38.1,62.23
N$98  (via drill 0.35)
  other vias: 38.73,62.23
N$99  (via drill 0.35)
  other vias: 39.37,62.23
N$100  (via drill 0.35)
  other vias: 39.37,63.5
N$101  (via drill 0.35)
  other vias: 38.73,63.5
N$102  (via drill 0.35)
  other vias: 38.1,63.5
N$103  (via drill 0.35)
  other vias: 37.47,63.5
N$104  (via drill 0.35)
  other vias: 36.83,63.5
N$105  (via drill 0.35)
  other vias: 36.2,63.5
N$106  (via drill 0.35)
  other vias: 46.35,62.23
N$107  (via drill 0.35)
  other vias: 46.35,63.5
N$108  (via drill 0.35)
  other vias: 46.99,63.5
N$109  (via drill 0.35)
  other vias: 46.99,62.23
N$110  (via drill 0.35)
  other vias: 60.96,63.5
N$111  (via drill 0.35)
  other vias: 60.96,62.23
N$112  (via drill 0.35)
  other vias: 61.59,62.23
N$113  (via drill 0.35)
  other vias: 61.59,63.5
N$114  (via drill 0.35)
  other vias: 12.06,30.48
N$115  (via drill 0.35)
  other vias: 10.79,30.48
N$116  (via drill 0.35)
  other vias: 10.79,29.84
N$117  (via drill 0.35)
  other vias: 12.06,29.84
N$118  (via drill 0.35)
  other vias: 15.24,33.02
N$119  (via drill 0.35)
  other vias: 15.24,34.29
N$120  (via drill 0.35)
  other vias: 14.61,34.29
N$121  (via drill 0.35)
  other vias: 26.04,33.66
N$122  (via drill 0.35)
  other vias: 26.04,33.02
N$123  (via drill 0.35)
  other vias: 25.4,33.02
N$124  (via drill 0.35)
  other vias: 24.77,33.02
N$125  (via drill 0.35)
  other vias: 24.13,33.02
N$126  (via drill 0.35)
  other vias: 23.5,33.02
N$127  (via drill 0.35)
  other vias: 22.86,33.02
N$128  (via drill 0.35)
  other vias: 22.23,33.02
N$129  (via drill 0.35)
  other vias: 22.23,34.29
N$130  (via drill 0.35)
  other vias: 22.86,34.29
N$131  (via drill 0.35)
  other vias: 23.5,34.29
N$132  (via drill 0.35)
  other vias: 24.13,34.29
N$133  (via drill 0.35)
  other vias: 24.77,34.29
N$134  (via drill 0.35)
  other vias: 25.4,34.29
N$135  (via drill 0.35)
  other vias: 35.56,34.29
N$136  (via drill 0.35)
  other vias: 35.56,33.66
N$137  (via drill 0.35)
  other vias: 35.56,33.02
N$138  (via drill 0.35)
  other vias: 36.2,33.02
N$139  (via drill 0.35)
  other vias: 36.83,33.02
N$140  (via drill 0.35)
  other vias: 37.47,33.02
N$141  (via drill 0.35)
  other vias: 38.1,33.02
N$142  (via drill 0.35)
  other vias: 38.73,33.02
N$143  (via drill 0.35)
  other vias: 39.37,33.02
N$144  (via drill 0.35)
  other vias: 39.37,34.29
N$145  (via drill 0.35)
  other vias: 38.73,34.29
N$146  (via drill 0.35)
  other vias: 38.1,34.29
N$147  (via drill 0.35)
  other vias: 37.47,34.29
N$148  (via drill 0.35)
  other vias: 36.83,34.29
N$149  (via drill 0.35)
  other vias: 36.2,34.29
N$150  (via drill 0.35)
  other vias: 46.35,33.02
N$151  (via drill 0.35)
  other vias: 46.35,34.29
N$152  (via drill 0.35)
  other vias: 46.99,34.29
N$153  (via drill 0.35)
  other vias: 46.99,33.02
N$154  (via drill 0.35)
  other vias: 60.96,34.29
N$155  (via drill 0.35)
  other vias: 60.96,33.02
N$156  (via drill 0.35)
  other vias: 61.59,33.02
N$157  (via drill 0.35)
  other vias: 61.59,34.29
N$158  (via drill 0.35)
  other vias: 54.61,91.44
N$159  (via drill 0.35)
  other vias: 53.98,91.44
N$160  (via drill 0.35)
  other vias: 53.98,92.71
N$161  (via drill 0.35)
  other vias: 53.98,62.23
N$162  (via drill 0.35)
  other vias: 53.98,63.5
N$163  (via drill 0.35)
  other vias: 54.61,63.5
N$164  (via drill 0.35)
  other vias: 54.61,62.23
N$165  (via drill 0.35)
  other vias: 53.98,33.02
N$166  (via drill 0.35)
  other vias: 53.98,34.29
N$167  (via drill 0.35)
  other vias: 54.61,34.29
N$168  (via drill 0.35)
  other vias: 54.61,33.02
N$169  (via drill 0.35)
  other vias: 81.28,57.15
N$170  (via drill 0.35)
  other vias: 81.92,57.15
N$171  (via drill 0.35)
  other vias: 59.05,52.7
N$172  (via drill 0.35)
  other vias: 67.94,79.38
N$173  (via drill 0.35)
  other vias: 66.67,79.38
N$174  (via drill 0.35)
  other vias: 66.67,78.74
N$175  (via drill 0.35)
  other vias: 67.94,78.74
N$176  (via drill 0.35)
  other vias: 73.03,86.36
N$177  (via drill 0.35)
  other vias: 73.03,85.09
N$178  (via drill 0.35)
  other vias: 73.66,85.09
N$179  (via drill 0.35)
  other vias: 73.66,86.36
N$180  (via drill 0.35)
  other vias: 81.28,86.36
N$181  (via drill 0.35)
  other vias: 81.92,85.09
N$182  (via drill 0.35)
  other vias: 81.92,86.36
N$183  (via drill 0.35)
  other vias: 67.94,50.16
N$184  (via drill 0.35)
  other vias: 66.67,50.16
N$185  (via drill 0.35)
  other vias: 66.67,49.53
N$186  (via drill 0.35)
  other vias: 67.94,49.53
N$187  (via drill 0.35)
  other vias: 73.03,55.88
N$188  (via drill 0.35)
  other vias: 73.03,57.15
N$189  (via drill 0.35)
  other vias: 73.66,57.15
N$190  (via drill 0.35)
  other vias: 73.66,55.88
N$191  (via drill 0.35)
  other vias: 81.92,55.88
N$192  (via drill 0.35)
  other vias: 67.94,21.59
N$193  (via drill 0.35)
  other vias: 66.67,21.59
N$194  (via drill 0.35)
  other vias: 66.67,20.95
N$195  (via drill 0.35)
  other vias: 67.94,20.95
N$196  (via drill 0.35)
  other vias: 73.03,27.3
N$197  (via drill 0.35)
  other vias: 73.03,28.57
N$198  (via drill 0.35)
  other vias: 73.66,28.57
N$199  (via drill 0.35)
  other vias: 73.66,27.3
N$200  (via drill 0.35)
  other vias: 81.28,28.57
N$201  (via drill 0.35)
  other vias: 81.92,28.57
N$202  (via drill 0.35)
  other vias: 81.92,27.3
N$203  (via drill 0.35)
  other vias: 59.69,23.5
N$204  (via drill 0.35)
  other vias: 60.33,22.86
N$205  (via drill 0.35)
  other vias: 85.72,18.41
N$206  (via drill 0.35)
  other vias: 35.56,85.72
N$207  (via drill 0.35)
  other vias: 35.56,85.09
N$208  (via drill 0.35)
  other vias: 35.56,84.45
N$209  (via drill 0.35)
  other vias: 36.2,84.45
N$210  (via drill 0.35)
  other vias: 36.83,84.45
N$211  (via drill 0.35)
  other vias: 37.47,84.45
N$212  (via drill 0.35)
  other vias: 38.1,84.45
N$213  (via drill 0.35)
  other vias: 38.73,84.45
N$214  (via drill 0.35)
  other vias: 39.37,84.45
N$215  (via drill 0.35)
  other vias: 36.2,85.72
N$216  (via drill 0.35)
  other vias: 36.83,85.72
N$217  (via drill 0.35)
  other vias: 37.47,85.72
N$218  (via drill 0.35)
  other vias: 38.1,85.72
N$219  (via drill 0.35)
  other vias: 38.73,85.72
N$220  (via drill 0.35)
  other vias: 39.37,85.72
N$221  (via drill 0.35)
  other vias: 26.04,85.72
N$222  (via drill 0.35)
  other vias: 26.04,85.09
N$223  (via drill 0.35)
  other vias: 26.04,84.45
N$224  (via drill 0.35)
  other vias: 25.4,84.45
N$225  (via drill 0.35)
  other vias: 25.4,85.72
N$226  (via drill 0.35)
  other vias: 24.77,85.72
N$227  (via drill 0.35)
  other vias: 24.77,84.45
N$228  (via drill 0.35)
  other vias: 24.13,84.45
N$229  (via drill 0.35)
  other vias: 24.13,85.72
N$230  (via drill 0.35)
  other vias: 23.5,85.72
N$231  (via drill 0.35)
  other vias: 23.5,84.45
N$232  (via drill 0.35)
  other vias: 22.86,84.45
N$233  (via drill 0.35)
  other vias: 22.86,85.72
N$234  (via drill 0.35)
  other vias: 22.23,85.72
N$235  (via drill 0.35)
  other vias: 22.23,84.45
N$236  (via drill 0.35)
  other vias: 47.62,83.19
N$237  (via drill 0.35)
  other vias: 47.62,81.92
N$238  (via drill 0.35)
  other vias: 46.99,82.55
N$239  (via drill 0.35)
  other vias: 62.23,79.38
N$240  (via drill 0.35)
  other vias: 62.23,78.74
N$241  (via drill 0.35)
  other vias: 62.23,78.11
N$242  (via drill 0.35)
  other vias: 62.23,77.47
N$243  (via drill 0.35)
  other vias: 62.23,76.83
N$244  (via drill 0.35)
  other vias: 62.23,76.2
N$245  (via drill 0.35)
  other vias: 62.23,75.56
N$246  (via drill 0.35)
  other vias: 62.23,74.93
N$247  (via drill 0.35)
  other vias: 62.23,74.3
N$248  (via drill 0.35)
  other vias: 62.23,73.66
N$249  (via drill 0.35)
  other vias: 62.23,73.03
N$250  (via drill 0.35)
  other vias: 62.23,72.39
N$251  (via drill 0.35)
  other vias: 62.23,71.75
N$252  (via drill 0.35)
  other vias: 62.87,71.12
N$253  (via drill 0.35)
  other vias: 63.5,70.48
N$254  (via drill 0.35)
  other vias: 64.14,69.85
N$255  (via drill 0.35)
  other vias: 64.77,69.22
N$256  (via drill 0.35)
  other vias: 26.04,56.52
N$257  (via drill 0.35)
  other vias: 66.04,68.58
N$258  (via drill 0.35)
  other vias: 26.04,55.88
N$259  (via drill 0.35)
  other vias: 74.93,69.85
N$260  (via drill 0.35)
  other vias: 74.93,68.58
N$261  (via drill 0.35)
  other vias: 75.56,68.58
N$262  (via drill 0.35)
  other vias: 75.56,69.85
N$263  (via drill 0.35)
  other vias: 26.04,55.24
N$264  (via drill 0.35)
  other vias: 25.4,55.24
N$265  (via drill 0.35)
  other vias: 24.77,55.24
N$266  (via drill 0.35)
  other vias: 24.13,55.24
N$267  (via drill 0.35)
  other vias: 23.5,55.24
N$268  (via drill 0.35)
  other vias: 22.86,55.24
N$269  (via drill 0.35)
  other vias: 22.23,55.24
N$270  (via drill 0.35)
  other vias: 22.23,56.52
N$271  (via drill 0.35)
  other vias: 22.86,56.52
N$272  (via drill 0.35)
  other vias: 23.5,56.52
N$273  (via drill 0.35)
  other vias: 24.13,56.52
N$274  (via drill 0.35)
  other vias: 24.77,56.52
N$275  (via drill 0.35)
  other vias: 25.4,56.52
N$276  (via drill 0.35)
  other vias: 35.56,56.52
N$277  (via drill 0.35)
  other vias: 35.56,55.88
N$278  (via drill 0.35)
  other vias: 35.56,55.24
N$279  (via drill 0.35)
  other vias: 36.2,55.24
N$280  (via drill 0.35)
  other vias: 36.83,55.24
N$281  (via drill 0.35)
  other vias: 37.47,55.24
N$282  (via drill 0.35)
  other vias: 38.1,55.24
N$283  (via drill 0.35)
  other vias: 38.73,55.24
N$284  (via drill 0.35)
  other vias: 39.37,55.24
N$285  (via drill 0.35)
  other vias: 39.37,56.52
N$286  (via drill 0.35)
  other vias: 38.73,56.52
N$287  (via drill 0.35)
  other vias: 38.1,56.52
N$288  (via drill 0.35)
  other vias: 37.47,56.52
N$289  (via drill 0.35)
  other vias: 36.83,56.52
N$290  (via drill 0.35)
  other vias: 36.2,56.52
N$291  (via drill 0.35)
  other vias: 47.62,53.98
N$292  (via drill 0.35)
  other vias: 47.62,52.7
N$293  (via drill 0.35)
  other vias: 46.99,53.34
N$294  (via drill 0.35)
  other vias: 59.69,52.07
N$295  (via drill 0.35)
  other vias: 60.96,22.23
N$296  (via drill 0.35)
  other vias: 70.48,40.64
N$297  (via drill 0.35)
  other vias: 70.48,39.37
N$298  (via drill 0.35)
  other vias: 71.12,39.37
N$299  (via drill 0.35)
  other vias: 71.12,40.64
N$300  (via drill 0.35)
  other vias: 79.38,40.64
N$301  (via drill 0.35)
  other vias: 79.38,39.37
N$302  (via drill 0.35)
  other vias: 78.74,39.37
N$303  (via drill 0.35)
  other vias: 78.74,40.64
N$304  (via drill 0.35)
  other vias: 86.36,46.99
N$305  (via drill 0.35)
  other vias: 86.36,45.72
N$306  (via drill 0.35)
  other vias: 85.72,46.35
N$307  (via drill 0.35)
  other vias: 85.72,46.99
N$308  (via drill 0.35)
  other vias: 26.04,26.04
N$309  (via drill 0.35)
  other vias: 26.04,26.67
N$310  (via drill 0.35)
  other vias: 26.04,27.3
N$311  (via drill 0.35)
  other vias: 25.4,27.3
N$312  (via drill 0.35)
  other vias: 24.77,27.3
N$313  (via drill 0.35)
  other vias: 24.13,27.3
N$314  (via drill 0.35)
  other vias: 23.5,27.3
N$315  (via drill 0.35)
  other vias: 22.86,27.3
N$316  (via drill 0.35)
  other vias: 22.23,27.3
N$317  (via drill 0.35)
  other vias: 22.23,26.04
N$318  (via drill 0.35)
  other vias: 22.86,26.04
N$319  (via drill 0.35)
  other vias: 23.5,26.04
N$320  (via drill 0.35)
  other vias: 24.13,26.04
N$321  (via drill 0.35)
  other vias: 24.77,26.04
N$322  (via drill 0.35)
  other vias: 25.4,26.04
N$323  (via drill 0.35)
  other vias: 35.56,27.3
N$324  (via drill 0.35)
  other vias: 35.56,26.67
N$325  (via drill 0.35)
  other vias: 35.56,26.04
N$326  (via drill 0.35)
  other vias: 36.2,26.04
N$327  (via drill 0.35)
  other vias: 36.83,26.04
N$328  (via drill 0.35)
  other vias: 37.47,26.04
N$329  (via drill 0.35)
  other vias: 38.1,26.04
N$330  (via drill 0.35)
  other vias: 38.73,26.04
N$331  (via drill 0.35)
  other vias: 39.37,26.04
N$332  (via drill 0.35)
  other vias: 39.37,27.3
N$333  (via drill 0.35)
  other vias: 38.73,27.3
N$334  (via drill 0.35)
  other vias: 38.1,27.3
N$335  (via drill 0.35)
  other vias: 37.47,27.3
N$336  (via drill 0.35)
  other vias: 36.83,27.3
N$337  (via drill 0.35)
  other vias: 36.2,27.3
N$338  (via drill 0.35)
  other vias: 47.62,24.77
N$339  (via drill 0.35)
  other vias: 47.62,23.5
N$340  (via drill 0.35)
  other vias: 46.99,24.13
N$342  (via drill 0.35)
  other vias: 66.67,11.43
N$343  (via drill 0.35)
  other vias: 66.67,10.16
N$344  (via drill 0.35)
  other vias: 67.31,10.16
N$345  (via drill 0.35)
  other vias: 67.31,11.43
N$346  (via drill 0.35)
  other vias: 76.83,11.43
N$347  (via drill 0.35)
  other vias: 76.83,10.16
N$348  (via drill 0.35)
  other vias: 77.47,10.16
N$349  (via drill 0.35)
  other vias: 77.47,11.43
N$350  (via drill 0.35)
  other vias: 85.72,17.78
N$351  (via drill 0.35)
  other vias: 86.36,17.14
N$352  (via drill 0.35)
  other vias: 86.36,18.41
R.1
  Top 0.406: X1.13 20.95,8.89 19.68,10.16 5.08,10.16 1.91,13.34 1.91,58.42 12.7,69.22 22.86,69.22 | R1.1 22.86,69.22 | 22.86,69.22 22.86,70.8 R4.2
R.2  (via drill 0.35)
  Top 0.406: R2.1 22.86,40.01 | 22.86,40.01 5.71,40.01 2.54,36.83 2.54,13.97 5.71,10.79 20.32,10.79 v21.59,9.53 | 22.86,40.01 22.86,41.59 R5.2
  Bottom 0.406: v21.59,9.53 19.68,7.62 19.68,4.45 X1.14
R.3  (via drill 0.35)
  Top 0.406: R3.1 v23.5,10.79 23.5,11.43 22.54,12.38 R6.2
  Bottom 0.406: v23.5,10.79 20.95,10.79 18.41,8.26 X1.15
V.1  (via drill 0.35)
  Top 0.406: v24.77,12.7 v30.48,12.7
  Bottom 0.406: U$2.VOLT 29.84,67.94 27.94,66.04 7.62,66.04 1.91,60.33 1.91,33.66 0.64,32.38 0.64,13.34 1.91,12.06 13.97,12.06 15.88,13.97 23.5,13.97 v24.77,12.7 | v30.48,12.7 29.84,12.06 29.84,4.45 X1.8
V.2
  Bottom 0.406: U$4.VOLT 29.84,38.1 28.57,36.83 7.62,36.83 1.91,31.11 1.91,14.61 3.17,13.34 12.7,13.34 14.61,15.24 25.4,15.24 27.3,13.34 27.3,12.06 24.77,9.53 24.77,4.45 X1.10
V.3  (via drill 0.35)
  Top 0.406: v31.11,8.89 23.5,8.89 22.23,7.62 22.23,4.45 X1.12
  Bottom 0.406: U$6.VOLT 29.84,20.32 31.75,18.41 31.75,9.53 v31.11,8.89

### Text on the board
tNames: EMERGENCY POWER SUPPLY | +12V | +12V | GND | GND | BATT2 | BATT2 | GND | GND | BATT3 | BATT3 | GND | GND | GND GND R.3 R.1 C.3 C.2 C.1 5V 5V 12V / GND GND GND R.2 V.3 V.2 V.1 5V 5V 12V